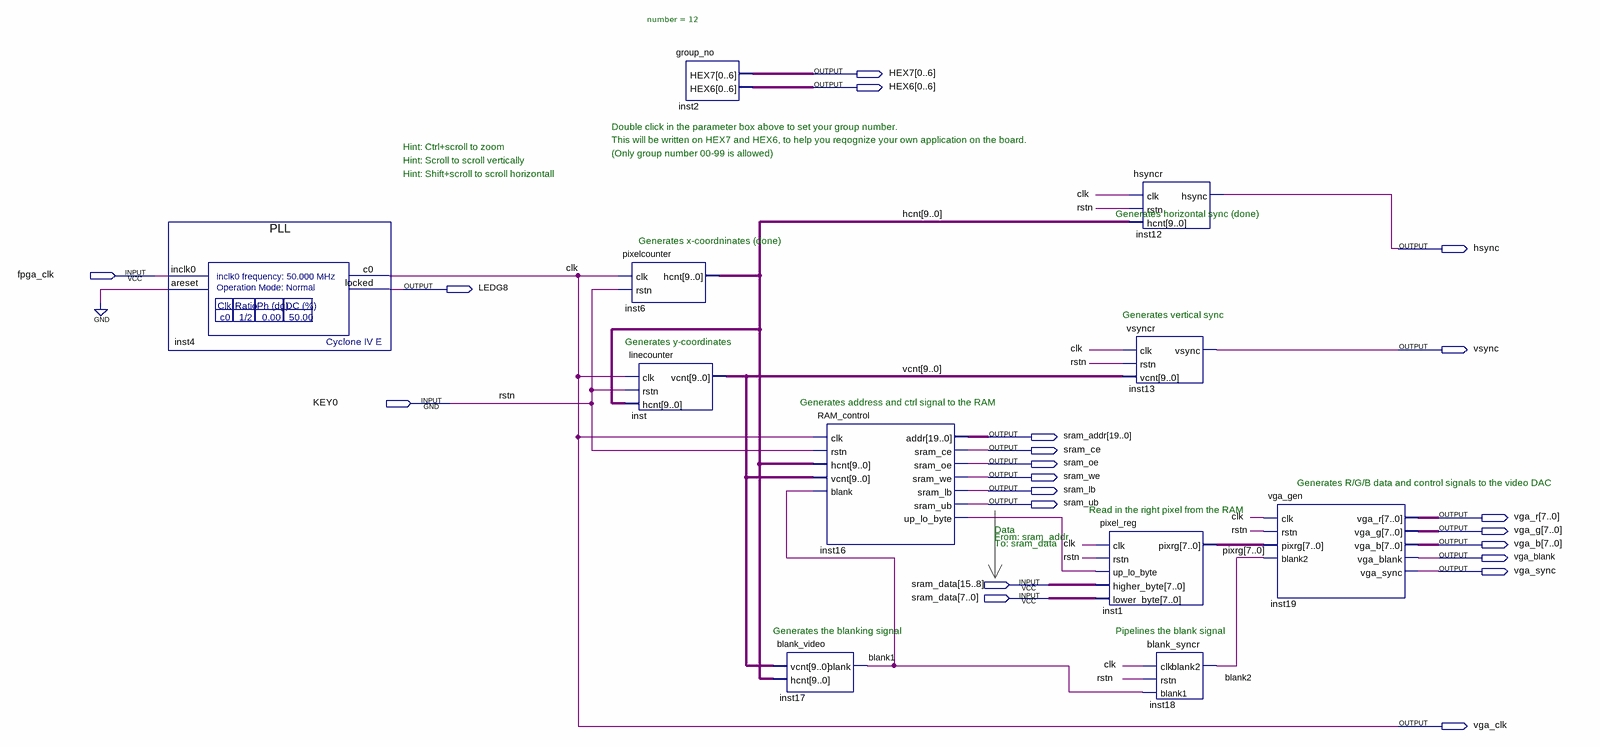
[diagram p0: schematic sheet]
// Quartus schematic VGA_contr.bdf as structural Verilog: 11 symbols, 21 pins
module VGA_contr (
  input  fpga_clk,
  input  KEY0,
  input  [15:0] sram_data,
  output [0:6] HEX7,
  output [0:6] HEX6,
  output hsync,
  output LEDG8,
  output vsync,
  output [19:0] sram_addr,
  output sram_ce,
  output sram_oe,
  output sram_we,
  output sram_lb,
  output sram_ub,
  output [7:0] vga_r,
  output [7:0] vga_g,
  output [7:0] vga_b,
  output vga_blank,
  output vga_sync,
  output vga_clk
);

  wire blank1, blank2, inst16_up_lo_byte;
  wire [7:0] pixrg;
  wire [9:0] hcnt, vcnt;

  PLL inst4 (.inclk0(fpga_clk), .areset(1'b0), .c0(vga_clk), .locked(LEDG8));
  pixelcounter inst6 (.clk(vga_clk), .rstn(KEY0), .hcnt(hcnt));
  linecounter inst (.clk(vga_clk), .hcnt(hcnt), .rstn(KEY0), .vcnt(vcnt));
  group_no #(.number(12)) inst2 (.HEX7(HEX7), .HEX6(HEX6));
  RAM_control inst16 (
    .clk(vga_clk), .rstn(KEY0), .hcnt(hcnt), .vcnt(vcnt), .blank(blank1), .addr(sram_addr),
    .sram_ce(sram_ce), .sram_oe(sram_oe), .sram_we(sram_we), .sram_lb(sram_lb), .sram_ub(sram_ub),
    .up_lo_byte(inst16_up_lo_byte));
  blank_video inst17 (.vcnt(vcnt), .hcnt(hcnt), .blank(blank1));
  hsyncr inst12 (.clk(vga_clk), .hcnt(hcnt), .rstn(KEY0), .hsync(hsync));
  vsyncr inst13 (.clk(vga_clk), .vcnt(vcnt), .rstn(KEY0), .vsync(vsync));
  pixel_reg inst1 (
    .clk(vga_clk), .rstn(KEY0), .up_lo_byte(inst16_up_lo_byte), .higher_byte(sram_data[15:8]),
    .lower_byte(sram_data[7:0]), .pixrg(pixrg));
  blank_syncr inst18 (.clk(vga_clk), .rstn(KEY0), .blank1(blank1), .blank2(blank2));
  vga_gen inst19 (
    .clk(vga_clk), .rstn(KEY0), .pixrg(pixrg), .blank2(blank2), .vga_r(vga_r), .vga_g(vga_g), .vga_b(vga_b),
    .vga_blank(vga_blank), .vga_sync(vga_sync));

  // Other names for the same wires on the sheet: clk = vga_clk; rstn = KEY0

  // Notes on the sheet:
  //   Double click in the parameter box above to set your group number.
  //   This will be written on HEX7 and HEX6, to help you reqognize your own application on the board.
  //   Hint: Ctrl+scroll to zoom
  //   (Only group number 00-99 is allowed)
  //   Hint: Scroll to scroll vertically
  //   Hint: Shift+scroll to scroll horizontall
  //   Generates horizontal sync (done)
  //   Generates x-coordninates (done)
  //   Generates vertical sync
  //   Generates y-coordinates
  //   Generates address and ctrl signal to the RAM
  //   Generates R/G/B data and control signals to the video DAC
  //   Read in the right pixel from the RAM
  //   Data
  //   From: sram_addr
  //   To: sram_data
  //   Generates the blanking signal
  //   Pipelines the blank signal
endmodule
